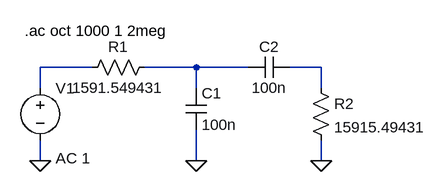
[diagram p0: schematic bpf_1st_ord_100hz-1khz_cutoff.asc]
bpf_1st_ord_100hz-1khz_cutoff.asc, the LTspice schematic file:
Version 4.1
SHEET 1 880 680
WIRE 144 96 64 96
WIRE 304 96 224 96
WIRE 384 96 304 96
WIRE 496 96 448 96
WIRE 64 128 64 96
WIRE 304 128 304 96
WIRE 496 128 496 96
WIRE 64 240 64 208
WIRE 304 240 304 192
WIRE 496 240 496 208
FLAG 304 240 0
FLAG 64 240 0
FLAG 496 240 0
SYMBOL voltage 64 112 R0
WINDOW 3 24 152 Left 2
WINDOW 123 24 124 Left 2
WINDOW 39 0 0 Left 0
SYMATTR Value ""
SYMATTR Value2 AC 1
SYMATTR InstName V1
SYMBOL res 240 80 R90
WINDOW 0 0 56 VBottom 2
WINDOW 3 32 56 VTop 2
SYMATTR InstName R1
SYMATTR Value 1591.549431
SYMBOL cap 288 128 R0
SYMATTR InstName C1
SYMATTR Value 100n
SYMBOL cap 448 80 R90
WINDOW 0 0 32 VBottom 2
WINDOW 3 32 32 VTop 2
SYMATTR InstName C2
SYMATTR Value 100n
SYMBOL res 480 112 R0
SYMATTR InstName R2
SYMATTR Value 15915.49431
TEXT 40 40 Left 2 !.ac oct 1000 1 2meg

The netlist it stands for:
* bpf_1st_ord_100hz-1khz_cutoff.asc
V1 N001 0 AC 1
R1 N002 N001 1591.549431
C1 N002 0 100n
C2 N003 N002 100n
R2 N003 0 15915.49431
.ac oct 1000 1 2meg
.backanno
.end